# Altium schematic sheet Top Level.SchDoc
size A4
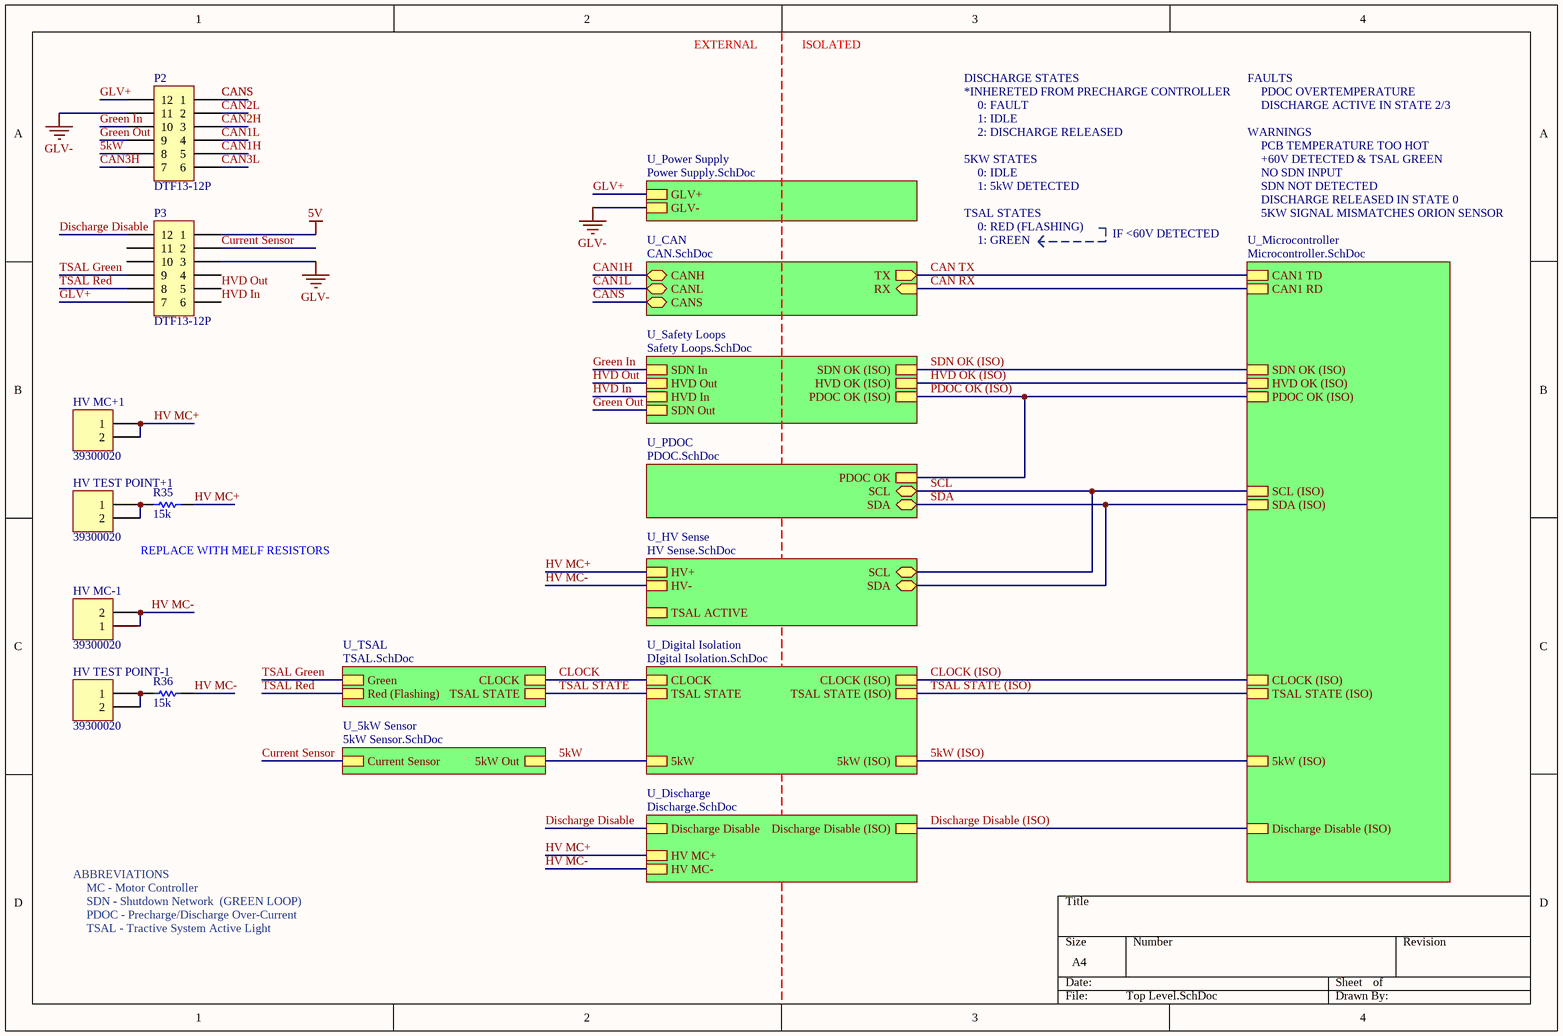
[diagram p0: Top Level.SchDoc]

## Parts
HV_MC+1  39300020  [39300020]
HV_MC-1  39300020  [39300020]
HV_TEST_POINT+1  39300020  [39300020]
HV_TEST_POINT-1  39300020  [39300020]
P2  DTF13-12P  [DTF13-12P]
P3  DTF13-12P  [DTF13-12P]
R35  15k  [0805]
R36  15k  [0805]

## Sub-sheets
U_5kW Sensor = 5kW Sensor.SchDoc: Current Sensor, 5kW Out
U_CAN = CAN.SchDoc: CANS (bidir), RX (in), CANL (bidir), CANH (bidir), TX (out)
U_Digital Isolation = DIgital Isolation.SchDoc: TSAL STATE, CLOCK, CLOCK (ISO), TSAL STATE (ISO), 5kW, 5kW (ISO)
U_Discharge = Discharge.SchDoc: HV MC+, HV MC-, Discharge Disable, Discharge Disable (ISO)
U_HV Sense = HV Sense.SchDoc: HV+, HV-, SCL (bidir), SDA (bidir), TSAL ACTIVE
U_Microcontroller = Microcontroller.SchDoc: CAN1 RD, CAN1 TD, SDN OK (ISO), HVD OK (ISO), PDOC OK (ISO), SDA (ISO), SCL (ISO), CLOCK (ISO), TSAL STATE (ISO), 5kW (ISO), Discharge Disable (ISO)
U_PDOC = PDOC.SchDoc: SCL (bidir), SDA (bidir), PDOC OK
U_Power Supply = Power Supply.SchDoc: GLV+, GLV-
U_Safety Loops = Safety Loops.SchDoc: HVD Out, SDN In, SDN OK (ISO), SDN Out, HVD In, HVD OK (ISO), PDOC OK (ISO)
U_TSAL = TSAL.SchDoc: CLOCK, TSAL STATE, Green, Red (Flashing)

## Nets
5V: P3.1
GLV-: P2.11 P3.3 ; sheet U_Power Supply/GLV-
5kW: P2.8 ; sheet U_5kW Sensor/5kW Out, sheet U_Digital Isolation/5kW
5kW (ISO): sheet U_Microcontroller/5kW (ISO), sheet U_Digital Isolation/5kW (ISO)
CAN1H: P2.5 ; sheet U_CAN/CANH
CAN1L: P2.4 ; sheet U_CAN/CANL
CAN2H: P2.3
CAN2L: P2.2
CAN3H: P2.7
CAN3L: P2.6
CAN RX: sheet U_CAN/RX, sheet U_Microcontroller/CAN1 RD
CAN TX: sheet U_CAN/TX, sheet U_Microcontroller/CAN1 TD
CANS: P2.1 ; sheet U_CAN/CANS
CLOCK: sheet U_TSAL/CLOCK, sheet U_Digital Isolation/CLOCK
CLOCK (ISO): sheet U_Microcontroller/CLOCK (ISO), sheet U_Digital Isolation/CLOCK (ISO)
Current Sensor: P3.2 ; sheet U_5kW Sensor/Current Sensor
Discharge Disable: P3.12 ; sheet U_Discharge/Discharge Disable
Discharge Disable (ISO): sheet U_Microcontroller/Discharge Disable (ISO), sheet U_Discharge/Discharge Disable (ISO)
GLV+: P2.12 P3.7 ; sheet U_Power Supply/GLV+
Green In: P2.10 ; sheet U_Safety Loops/SDN In
Green Out: P2.9 ; sheet U_Safety Loops/SDN Out
HV MC+: HV_MC+1.1 HV_MC+1.2 R35.2 ; sheet U_Discharge/HV MC+, sheet U_HV Sense/HV+
HV MC-: HV_MC-1.1 HV_MC-1.2 R36.2 ; sheet U_Discharge/HV MC-, sheet U_HV Sense/HV-
HVD In: P3.6 ; sheet U_Safety Loops/HVD In
HVD OK (ISO): sheet U_Safety Loops/HVD OK (ISO), sheet U_Microcontroller/HVD OK (ISO)
HVD Out: P3.5 ; sheet U_Safety Loops/HVD Out
PDOC OK (ISO): sheet U_Safety Loops/PDOC OK (ISO), sheet U_Microcontroller/PDOC OK (ISO), sheet U_PDOC/PDOC OK
SCL: sheet U_Microcontroller/SCL (ISO), sheet U_PDOC/SCL, sheet U_HV Sense/SCL
SDA: sheet U_Microcontroller/SDA (ISO), sheet U_PDOC/SDA, sheet U_HV Sense/SDA
SDN OK (ISO): sheet U_Safety Loops/SDN OK (ISO), sheet U_Microcontroller/SDN OK (ISO)
TSAL Green: P3.9 ; sheet U_TSAL/Green
TSAL Red: P3.8 ; sheet U_TSAL/Red (Flashing)
TSAL STATE: sheet U_TSAL/TSAL STATE, sheet U_Digital Isolation/TSAL STATE
TSAL STATE (ISO): sheet U_Microcontroller/TSAL STATE (ISO), sheet U_Digital Isolation/TSAL STATE (ISO)
NetHV_TEST_POINT+1_1: HV_TEST_POINT+1.1 HV_TEST_POINT+1.2 R35.1
NetHV_TEST_POINT-1_1: HV_TEST_POINT-1.1 HV_TEST_POINT-1.2 R36.1

Not connected (* = marked no-connect by the designer): P3 4 10 11

## Notes on the sheet
- EXTERNAL
- ISOLATED
- DISCHARGE STATES
- *INHERETED FROM PRECHARGE CONTROLLER
- 0: FAULT
- FAULTS
- PDOC OVERTEMPERATURE
- DISCHARGE ACTIVE IN STATE 2/3
- 5KW STATES
- 1: IDLE
- 2: DISCHARGE RELEASED
- 0: IDLE
- WARNINGS
- PCB TEMPERATURE TOO HOT
- +60V DETECTED & TSAL GREEN
- NO SDN INPUT
- TSAL STATES
- 1: 5kW DETECTED
- 0: RED (FLASHING)
- 1: GREEN
- IF <60V DETECTED
- SDN NOT DETECTED
- DISCHARGE RELEASED IN STATE 0
- 5KW SIGNAL MISMATCHES ORION SENSOR
- REPLACE WITH MELF RESISTORS
- ABBREVIATIONS
- PDOC - Precharge/Discharge Over-Current
- SDN - Shutdown Network  (GREEN LOOP)
- MC - Motor Controller
- TSAL - Tractive System Active Light

## Library data of the parts
HV_MC+1 HV_MC-1 HV_TEST_POINT+1 HV_TEST_POINT-1 = 39300020: Positions: 2; Pitch: 4.2mm; Row Spacing: 5.5mm; Angle: 90; Flange: No; Contact: Tin; Part Number: 39300020; Digikey Part Number: WM21351-ND
P2 P3 = DTF13-12P[[/\]]DTF13-12P: Positions: 12; Pitch: 4.45mm; Angle: 90; Flange: Yes; Contact: Nickel; Part Number: DTF13-12P; Row Spacing: 4.45mm; Digikey Part Number: 1734-1861-ND; Digikey Link: https://www.digikey.com/product-detail/en/te-connectivity-deutsch-connectors/DTF13-12PA/1734-1861-ND/9744662
R35 R36 = RC0805FR0715KL: Manufacturer: YAGEO; Tolerance: 0.01; Rated Voltage: 0.125W; Part Number: RC0805FR0715KL; Value: 15k; Material: FR-07